# Altium project MemoryBoard_AT25DFxxx.PrjPcb
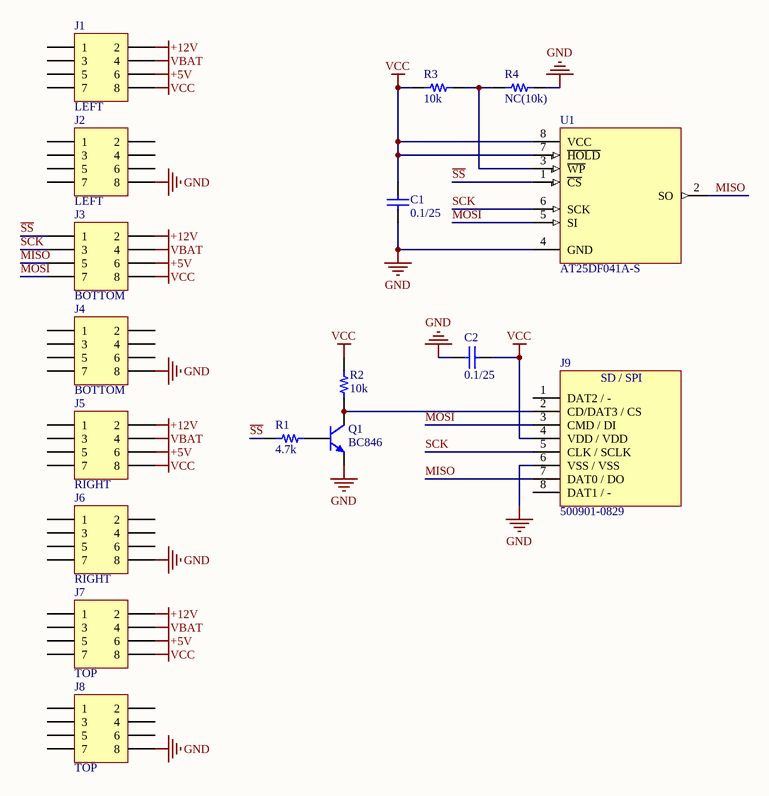
[diagram p0: MemoryBoard_AT25DFxxx.SchDoc]
1 sheet, 17 parts. Net scope: global (net labels, ports and power ports of the same name join across sheets).
Board file: MemoryBoard_AT25DFxxx.PcbDoc

## Sheet MemoryBoard_AT25DFxxx.SchDoc
size A4

### Parts
C1  0.1/25  [CAP0402]
C2  0.1/25  [CAP0402]
J1  LEFT  [PBDM-8]
J2  LEFT  [PBDM-8]
J3  BOTTOM  [PBDM-8]
J4  BOTTOM  [PBDM-8]
J5  RIGHT  [PBDM-8]
J6  RIGHT  [PBDM-8]
J7  TOP  [PBDM-8]
J8  TOP  [PBDM-8]
J9  500901-0829  [MOLEX 500901-0829]
Q1  BC846  [SOT23]
R1  4.7k  [RES0402]
R2  10k  [RES0402]
R3  10k  [RES0402]
R4  NC(10k)  [RES0402]
U1  AT25DF041A-S  [SO8-208]

### Nets
+5V: J1.6 J3.6 J5.6 J7.6
+12V: J1.2 J3.2 J5.2 J7.2
GND: C1.1 C2.2 J2.8 J4.8 J6.8 J8.8 J9.6(VSS_/_VSS) Q1.2 R4.2 U1.4(GND)
VBAT: J1.4 J3.4 J5.4 J7.4
VCC: C1.2 C2.1 J1.8 J3.8 J5.8 J7.8 J9.4(VDD_/_VDD) R2.1 R3.1 U1.7(~{HOLD}) U1.8(VCC)
MISO: J3.5 J9.7(DAT0_/_DO) U1.2(SO)
MOSI: J3.7 J9.3(CMD_/_DI) U1.5(SI)
~{SS}: J3.1 R1.1 U1.1(~{CS})
SCK: J3.3 J9.5(CLK_/_SCLK) U1.6(SCK)
NetJ9_2: J9.2(CD/DAT3_/_CS) Q1.3 R2.2
NetQ1_1: Q1.1 R1.2
NetR3_2: R3.2 R4.1 U1.3(~{WP})

Not connected (* = marked no-connect by the designer): J1 1 3 5 7; J2 1 2 3 4 5 6 7; J4 1 2 3 4 5 6 7; J5 1 3 5 7; J6 1 2 3 4 5 6 7; J7 1 3 5 7; J8 1 2 3 4 5 6 7; J9 1(DAT2_/_-) 8(DAT1_/_-)

### Notes on the sheet
- (in symbol 500901-0829) SD / SPI

### Library data of the parts
C1 C2 = CAP0402: Ceramic chip capacitor 0402; Value: 0.1; Voltage: 25; PartNumber: CAP0402; Category: Capacitor; Author: oiezhov
J1-J8 = PBDM-8: 2x4-pin header, pitch 2.54 mm; PartNumber: PBDM-8; Category: Connector; ComponentLink1Description: Datasheet; ComponentLink1URL: d:\_AltiumLibs\Pdf\Mechanical\Connector\pbsm.pdf; Author: oiezhov
J9 = 500901-0829: Micro SD card connector; PartNumber: 500901-0829; Category: Connector; ComponentLink1Description: Datasheet; ComponentLink1URL: d:\_AltiumLibs\Pdf\Mechanical\Connector\5009010801_sd.pdf; Author: oiezhov
Q1 = BC846: NPN Silicon AF Transistor; PartNumber: BC846; Category: Transistor; ComponentLink1Description: Datasheet; ComponentLink1URL: d:\_AltiumLibs\Pdf\Discrete\Transistor\BC846-BC850.pdf; Author: oiezhov
R1-R4 = RES0402: Ceramic chip resistor; PartNumber: RES0402; Category: Resistor; Author: oiezhov
  R1: Value: 4.7k
  R2 R3: Value: 10k
  R4: Value: NC(10k)
U1 = AT25DF041A-S: 4-Mbit Serial Peripheral Interface Serial Flash Memory; PartNumber: AT25DF041A-S; Category: IC/Memory; ComponentLink1Description: Datasheet; ComponentLink1URL: D:\_AltiumLibs\Pdf\IC\Memory\AT25DF041A.pdf; Author: oiezhov